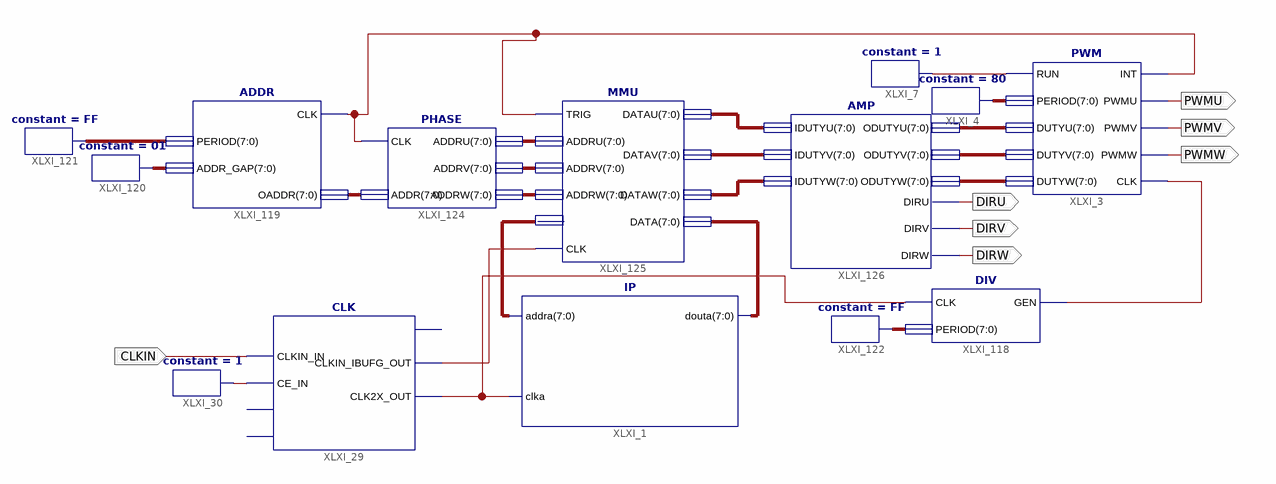
[diagram p0: schematic sheet 1]
// Xilinx ISE schematic main.sch (spartan3e) as structural Verilog: 14 symbols, 7 ports
module main (
  input  CLKIN,
  output PWMU,
  output PWMV,
  output PWMW,
  output DIRU,
  output DIRV,
  output DIRW
);

  wire XLXN_50, XLXN_257, XLXN_259, XLXN_268, XLXN_273, XLXN_274;
  wire [7:0] XLXN_178, XLXN_179, XLXN_211, XLXN_212, XLXN_213, XLXN_220, XLXN_221, XLXN_225, XLXN_236,
       XLXN_237, XLXN_238, XLXN_253, XLXN_254, XLXN_255, XLXN_256, XLXN_258;

  DIV XLXI_118 (.CLK(XLXN_274), .PERIOD(XLXN_258), .GEN(XLXN_259));
  constant #(.CValue("FF")) XLXI_122 (.O(XLXN_258));
  MMU XLXI_125 (
    .DATAU(XLXN_236), .DATAV(XLXN_238), .DATAW(XLXN_237), .TRIG(XLXN_268), .CLK(XLXN_273), .ADDRU(XLXN_211),
    .ADDRV(XLXN_212), .ADDRW(XLXN_213), .DATA(XLXN_221), .ADDR(XLXN_220));
  PHASE XLXI_124 (.CLK(XLXN_268), .ADDR(XLXN_225), .ADDRU(XLXN_211), .ADDRV(XLXN_212), .ADDRW(XLXN_213));
  ADDR XLXI_119 (.PERIOD(XLXN_178), .ADDR_GAP(XLXN_179), .OADDR(XLXN_225), .CLK(XLXN_268));
  constant #(.CValue("01")) XLXI_120 (.O(XLXN_179));
  constant #(.CValue("FF")) XLXI_121 (.O(XLXN_178));
  IP XLXI_1 (.addra(XLXN_220), .clka(XLXN_274), .douta(XLXN_221));
  AMP XLXI_126 (
    .IDUTYU(XLXN_236), .IDUTYV(XLXN_238), .IDUTYW(XLXN_237), .ODUTYU(XLXN_253), .ODUTYV(XLXN_254),
    .ODUTYW(XLXN_255), .DIRU(DIRU), .DIRV(DIRV), .DIRW(DIRW));
  constant #(.CValue("80")) XLXI_4 (.O(XLXN_256));
  PWM XLXI_3 (
    .DUTYU(XLXN_253), .DUTYV(XLXN_254), .DUTYW(XLXN_255), .INT(XLXN_268), .PWMU(PWMU), .PWMV(PWMV),
    .PWMW(PWMW), .CLK(XLXN_259), .RUN(XLXN_257), .PERIOD(XLXN_256));
  constant #(.CValue("1")) XLXI_7 (.O(XLXN_257));
  constant #(.CValue("1")) XLXI_30 (.O(XLXN_50));
  CLK XLXI_29 (
    .CLKIN_IN(CLKIN), .CE_IN(XLXN_50), .CLKIN_IBUFG_OUT(XLXN_273), .CLK2X_OUT(XLXN_274));  // open: PRE_IN, CLR_IN, DDR_CLK2X_OUT
endmodule
